# Altium project WR_NIC.PrjPcb (part 2 of 2)

## Sheet 13-Experimental.SchDoc
size B; SheetNumber: 10; SheetTotal: 17
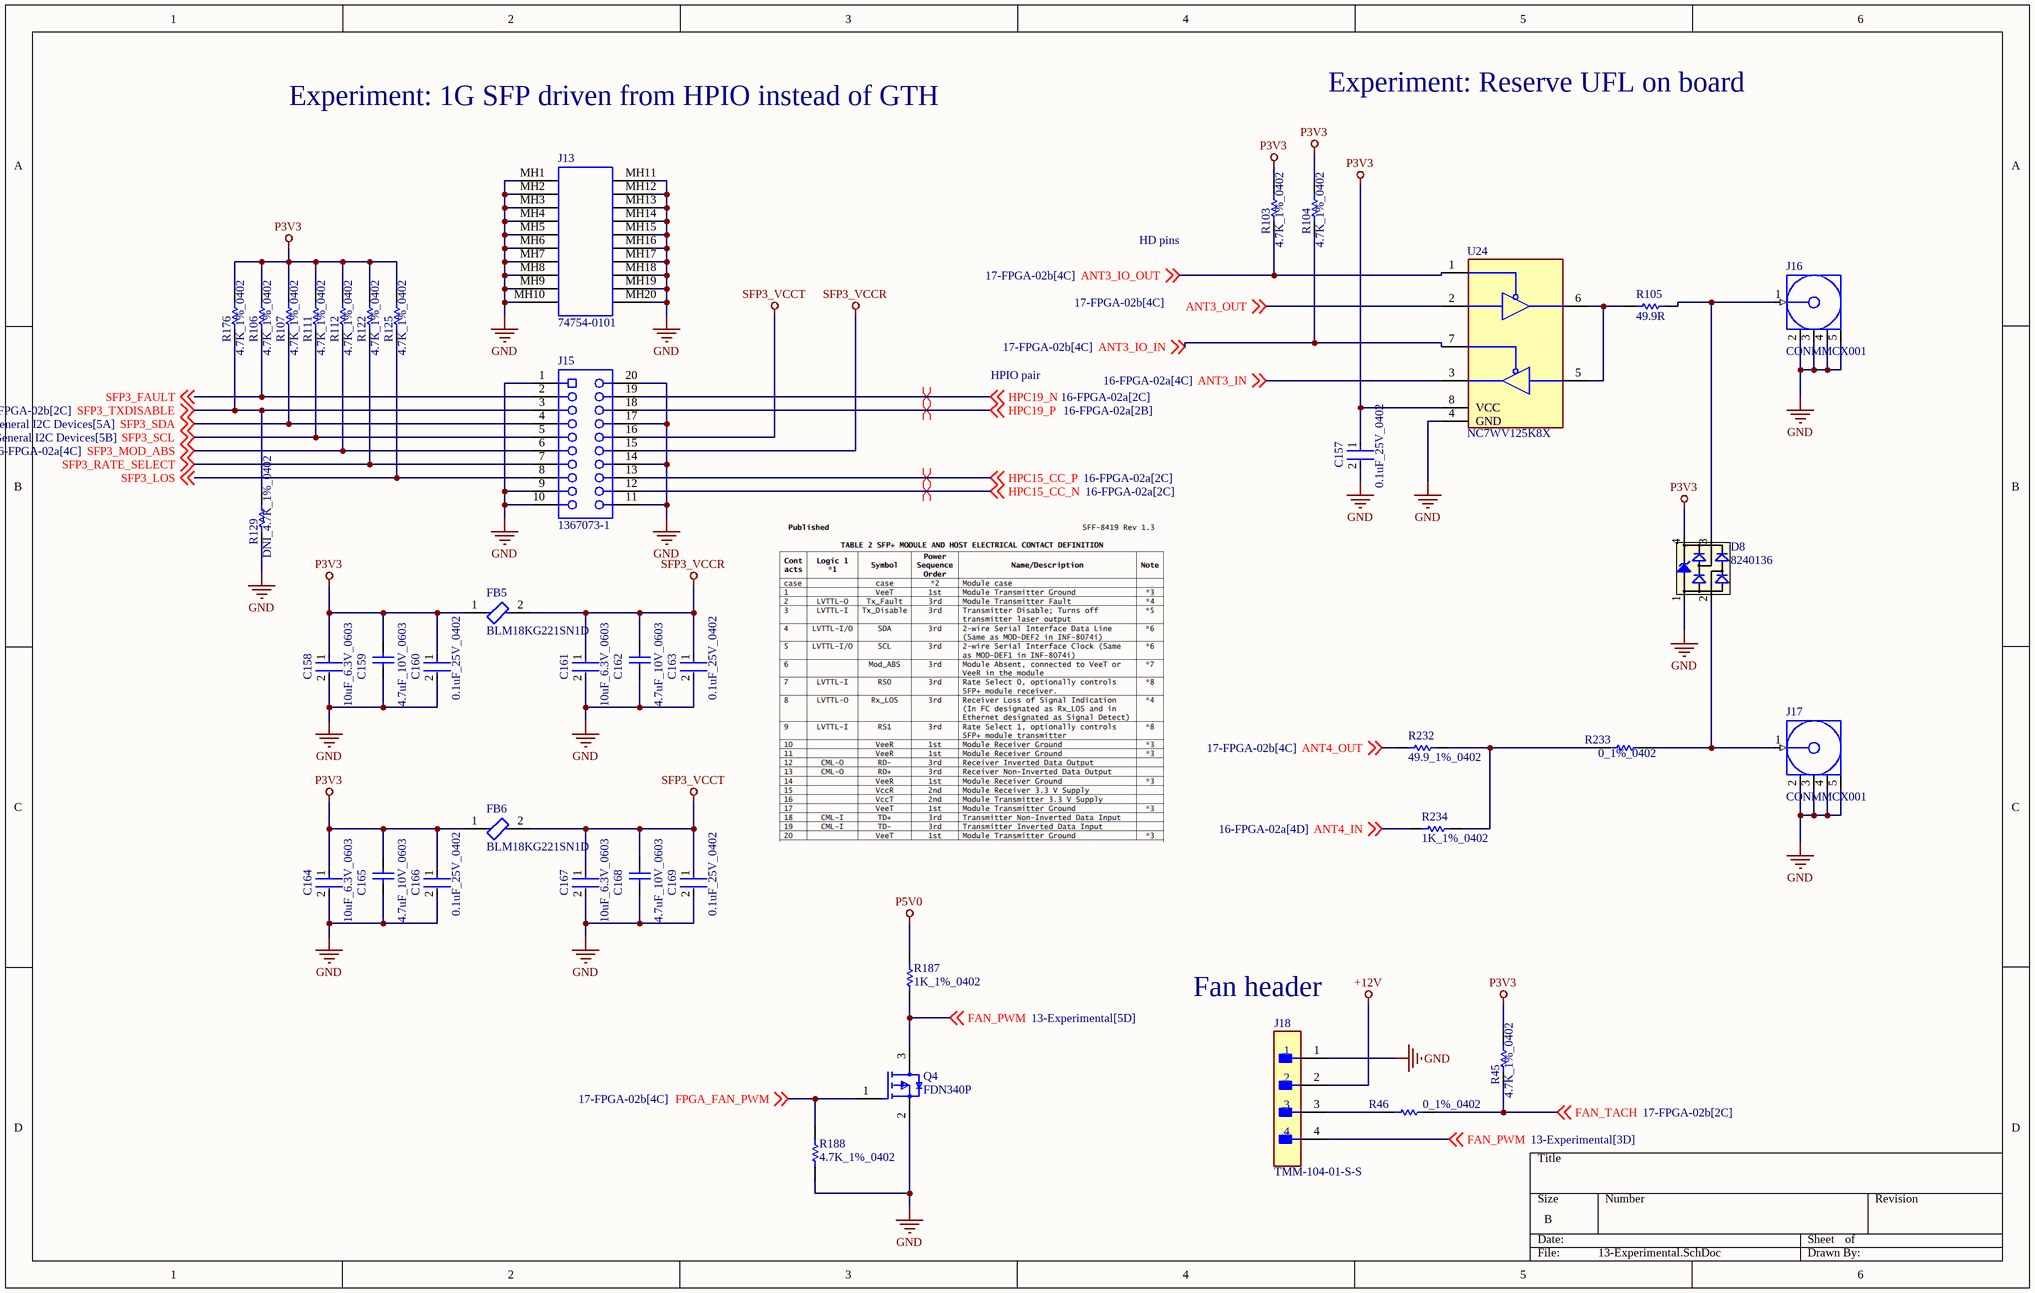
[diagram p4: 13-Experimental.SchDoc]

### Parts
C157  0.1uF_25V_0402  [FP-0402-L_1_0_1-W_0_5_0_1-IPC_C]
C158  10uF_6.3V_0603  [FP-C0603C106M9PACTU-MFG]
C159  4.7uF_10V_0603  [CAPC1608X87X35NL15T15]
C160  0.1uF_25V_0402  [FP-0402-L_1_0_1-W_0_5_0_1-IPC_C]
C161  10uF_6.3V_0603  [FP-C0603C106M9PACTU-MFG]
C162  4.7uF_10V_0603  [CAPC1608X87X35NL15T15]
C163  0.1uF_25V_0402  [FP-0402-L_1_0_1-W_0_5_0_1-IPC_C]
C164  10uF_6.3V_0603  [FP-C0603C106M9PACTU-MFG]
C165  4.7uF_10V_0603  [CAPC1608X87X35NL15T15]
C166  0.1uF_25V_0402  [FP-0402-L_1_0_1-W_0_5_0_1-IPC_C]
C167  10uF_6.3V_0603  [FP-C0603C106M9PACTU-MFG]
C168  4.7uF_10V_0603  [CAPC1608X87X35NL15T15]
C169  0.1uF_25V_0402  [FP-0402-L_1_0_1-W_0_5_0_1-IPC_C]
D8  8240136  [SOT143-4L]
FB5  BLM18KG221SN1D  [FP-BLM18-0_15-t0_8-IPC_B]
FB6  BLM18KG221SN1D  [FP-BLM18-0_15-t0_8-IPC_B]
J13  74754-0101  [MOLX-74754-0101_V]
J15  1367073-1  [TECO-1367073-1_V]
J16  CONMMCX001  [CON-MMCX]
J17  CONMMCX001  [CON-MMCX]
J18  TMM-104-01-S-S  [FP-TMM-104-01-S-S-MFG]
Q4  FDN340P  [FP-527AG-MFG]
R45  4.7K_1%_0402  [RESC1005X40X25NL10T10]
R46  0_1%_0402  [RESC1005X40X25LL05T05]
R103  4.7K_1%_0402  [RESC1005X40X25NL10T10]
R104  4.7K_1%_0402  [RESC1005X40X25NL10T10]
R105  49.9R  [RESC1608X55X25NL10T15]
R106  4.7K_1%_0402  [RESC1005X40X25NL10T10]
R107  4.7K_1%_0402  [RESC1005X40X25NL10T10]
R111  4.7K_1%_0402  [RESC1005X40X25NL10T10]
R112  4.7K_1%_0402  [RESC1005X40X25NL10T10]
R122  4.7K_1%_0402  [RESC1005X40X25NL10T10]
R125  4.7K_1%_0402  [RESC1005X40X25NL10T10]
R129  DNI_4.7K_1%_0402  [RESC1005X40X25NL10T10]  (no BOM)
R176  4.7K_1%_0402  [RESC1005X40X25NL10T10]
R187  1K_1%_0402  [RESC1005X40X25NL05T05]
R188  4.7K_1%_0402  [RESC1005X40X25NL10T10]
R232  49.9_1%_0402  [RESC1005X40X25NL10T10]
R233  0_1%_0402  [RESC1005X40X25LL05T05]
R234  1K_1%_0402  [RESC1005X40X25NL05T05]
U24  NC7WV125K8X  [SOP50P310X90-8N]

### Nets
+12V: J18.2
GND: C157.2 C158.2 C159.1 C160.2 C161.2 C162.1 C163.2 C164.2 C165.1 C166.2 C167.2 C168.1 C169.2 D8.1(GND) J13.MH1 J13.MH2 J13.MH3 J13.MH4 J13.MH5 J13.MH6 J13.MH7 J13.MH8 J13.MH9 J13.MH10 J13.MH11 J13.MH12 J13.MH13 J13.MH14 J13.MH15 J13.MH16 J13.MH17 J13.MH18 J13.MH19 J13.MH20 J15.1 J15.9 J15.10 J15.11 J15.14 J15.17 J15.20 J16.2(GND) J16.3(GND) J16.4(GND) J16.5(GND) J17.2(GND) J17.3(GND) J17.4(GND) J17.5(GND) J18.1 Q4.2(S) R129.2 R188.1 U24.4(GND)
P3V3: C157.1 C158.1 C159.2 C160.1 C164.1 C165.2 C166.1 D8.4(VDD) FB5.1 FB6.1 R45.1 R103.1 R104.1 R106.1 R107.1 R111.1 R112.1 R122.1 R125.1 R176.1 U24.8(VCC)
P5V0: R187.2
SFP3_VCCR: C161.1 C162.2 C163.1 FB5.2 J15.15
SFP3_VCCT: C167.1 C168.2 C169.1 FB6.2 J15.16
ANT3_IN: U24.3 ; off-sheet ANT3_IN
ANT3_IO_IN: R104.2 U24.7 ; off-sheet ANT3_IO_IN
ANT3_IO_OUT: R103.2 U24.1 ; off-sheet ANT3_IO_OUT
ANT3_OUT: U24.2 ; off-sheet ANT3_OUT
ANT4_IN: R234.1 ; off-sheet ANT4_IN
ANT4_OUT: R232.1 ; off-sheet ANT4_OUT
FAN_PWM: J18.4 Q4.3(D) R187.1 ; off-sheet FAN_PWM
FAN_TACH: R45.2 R46.2 ; off-sheet FAN_TACH
FPGA_FAN_PWM: Q4.1(G) R188.2 ; off-sheet FPGA_FAN_PWM
HPC15_CC_N: J15.12 ; off-sheet HPC15_CC_N
HPC15_CC_P: J15.13 ; off-sheet HPC15_CC_P
HPC19_N: J15.19 ; off-sheet HPC19_N
HPC19_P: J15.18 ; off-sheet HPC19_P
SFP3_FAULT: J15.2 R106.2 ; off-sheet SFP3_FAULT
SFP3_LOS: J15.8 R125.2 ; off-sheet SFP3_LOS
SFP3_MOD_ABS: J15.6 R112.2 ; off-sheet SFP3_MOD_ABS
SFP3_RATE_SELECT: J15.7 R122.2 ; off-sheet SFP3_RATE_SELECT
SFP3_SCL: J15.5 R111.2 ; off-sheet SFP3_SCL
SFP3_SDA: J15.4 R107.2 ; off-sheet SFP3_SDA
SFP3_TXDISABLE: J15.3 R129.1 R176.2 ; off-sheet SFP3_TXDISABLE
NetD8_2: D8.2(I/O1) J17.1(Signal) R233.2
NetD8_3: D8.3(I/O2) J16.1(Signal) R105.2
NetJ18_3: J18.3 R46.1
NetR105_1: R105.1 U24.5 U24.6
NetR232_2: R232.2 R233.1 R234.2

### Layout directives
differential pair: HPC15_CC_N, HPC15_CC_P, HPC19_N, HPC19_P

### Notes on the sheet
- Experiment: Reserve UFL on board
- Experiment: 1G SFP driven from HPIO instead of GTH
- HD pins
- HPIO pair
- Fan header

### Library data of the parts
C157 C160 C163 C166 C169 = CMP-2008-02519-2: General Purpose Ceramic Capacitor, 0402, 100nF, 10%, X7R, 15%, 25V; Package Quantity: 1; Capacitance: 100nF; Min Operating Temperature: -55°C; Voltage: 25V; Voltage Rating: 25V; Construction: Flat; Max Operating Temperature: 125°C; Radiation Hardening: No; Depth: 0.5mm; Thickness: 0.022inch; Voltage Rating (DC): 25V; Number of Pins: 2; Lead Free: Lead Free; Series: -; REACH SVHC: No SVHC; Length: 1mm; Dielectric: X7R; RoHS Compliant: Yes; Mount: Surface Mount; Packaging: Tape and Reel; Case/Package: 0402; Case Code (Imperial): 0402; Termination: SMD/SMT; Width: 0.02inch; Case Code (Metric): 1005; Tolerance: 10%
C158 C161 C164 C167 = CMP-2006-02285-3: CAP CER 10UF 6.3V X5R 0603; Manufacturer Part Number: C0603C106M9PACTU; Manufacturer: Kemet; Material: Ceramic; Temperature Coefficient: 15%; Tolerance: 20%; Category: Cap; Height: 0.9mm; Digikey Description: CAP CER 10UF 6.3V X5R 0603; Mouser Description: In a Pack of 10, KEMET 0603 (1608M) 10µF MLCC 6.3V dc ±20% SMD C0603C106M9PACTU; Voltage Rating: 6.3V; Device Class L2: Capacitors; Temperature Range Low: -55°C; Temperature Characteristic: X5R; ComponentLink2Description: Datasheet; Ipc Land Pattern Name: CAPC16080X80; ComponentLink2URL: http://www.kemet.com/Lists/ProductCatalog/Attachments/19/KEM_C1006_X5R_SMD.pdf; Capacitance: 10uF; Temperature Range High: +85°C; Device Class L3: Ceramic Capacitors; RoHS: TRUE; Automotive: No; Value: 10uF; Temperature: -55°C to +85°C; Device Class L1: Passive Components; Package: C0603C106M9PACTU; Lead Free: Yes; Octopart: https://octopart.com/c0603c106m9pactu-kemet-8375727
C159 C162 C165 C168 = CMP-2006-03238-1: Part Number: C0603C475K8PACTU; Manufacturer: Kemet
D8 = CMP-1486-00002-1: TVS Diode WE-TVS-HS, VRWM=3.3V; Manufacturer: Wuerth Elektronik; Reverse Stand Off Voltage: 3.3V; PartNumber: 8240136; ComponentLink1Description: Manufacturer URL; PackageReference: SOT143-4L; ComponentLink1URL: http://www.we-online.com; ComponentLink2Description: Datasheet; ComponentLink2URL: http://katalog.we-online.de/kataloge/eisos/media/pdf/8240136.pdf
FB5 FB6 = CMP-0686-00556-7: Chip Ferrite Bead, 0603, 220Ω @ 100MHz, 0.05Ω, 25%, 2.2A; DC Resistance (DCR): 50mR; Number of Circuits: 1; Impedance: 220R; Current Rating: 2.2A; Material: Ferrite; Test Frequency: 100MHz; Depth: 0.8mm; Series: BLM18K; RoHS Compliant: Yes; Termination: SMD/SMT; Max Current Rating: 2.2A; Case Code (Metric): 1608; Radiation Hardening: No; Number of Pins: 2; Length: 1.6mm; Lead Free: Lead Free; Package Quantity: 1; Height: 0.8mm; Core Material: Ferrite; Inductor Type: FERRITE BEAD; Min Operating Temperature: -55°C; Case/Package: 0603; Case Code (Imperial): 0603; Number of Lines: 1; Packaging: Tape and Reel; REACH SVHC: No SVHC; Max Operating Temperature: 125°C; Military Standard: Not; DC Resistance-Max: 50mR; Width: 0.8mm; DC Current: 2.2A; Max DC Current: 2.2A; Tolerance: 25%; Weight: 7.1E-05oz
J13 = CMP-1704-00003-3: SFP+ Cage, Single Port, Height 10.85 mm, Tail Height 3.05 mm, -40 to 85 degC, RoHS, Tray; RoHSCompliant: True; ComponentLink3URL: http://www.molex.com/pdm_docs/sd/747540101_sd.pdf; Width: 49 mm; Height: 10.85 mm; Mounting Technology: Through Hole; ComponentLink2Description: Datasheet; ComponentLink3Description: Package Specification; DatasheetVersion: Rev. Jul-15; Package Quantity: 1152; PackageDescription: SFP+ Cage, Single Port, Height 10.85 mm, Tail Height 3.05 mm; Radiation Hardening: No; PackageVersion: Rev. J, 02/2015; ComponentLink1Description: Manufacturer URL; PartNumber: 74754-0101; ComponentLink1URL: http://www.molex.com/; Packaging: Tray; Length: 15.9 mm; ComponentLink2URL: http://www.molex.com/webdocs/datasheets/pdf/en-us/0747540101_IO_CONNECTORS.pdf
J15 = CMP-2000-05488-1: Female Connector, Pitch 0.8 mm, 2 x 10 Position, Height 5.4 mm, -55 to 85 degC, RoHS, Tape and Reel; Manufacturer: TE Connectivity; Product Training Modules: HighSpeedPluggableI/OSolutions; 3D Model: 1367073-1.pdf; Connector Type: SFP; Other Names: A97430DKR; Mating Products: 516-2084-ND / -TXRXOPTICALSFF1.25GBDISCSI; Dynamic Catalog: SFPConnectors; Featured Product: HighSpeedPluggableI-OSolutions; Connector Style: Receptacle; Associated Product: A103997CT-ND / -CONNSFPCAGESINGLEW/OPIPE / A103997TR-ND / -CONNSFPCAGESINGLEW/OPIPE / 1367645-3-ND / -CONNCAGE&HEATSINKSGLPORTTIN / 1367645-2-ND / -CONNCAGE&HEATSINKSGLPORTTIN / 1888424-1-ND / -CONNCAGE1X2SFPENHANCEDEMI / 1367643-1-ND / -CONNCAGESNGLPORTDBLSIDETIN / 1489962-1-ND / -CONNSFPCAGESINGLEW/OPIPE / 1367645-1-ND / -CONNCAGE&HEATSINKSGLPORTTIN / A99375-ND / -CONNSFPCAGE1X4PIN-IN-PASTE / A97412CT-ND / -CONNSFPLOWERCAGEPCB / More...; Number of Positions: 20; Package Reference: 1367073-1; Package Description: Female Connector, Pitch 0.8 mm, 2 x 10 Position, Height 5.4 mm; RoHS Information: 1367073-1StatementofCompliance; Contact Finish: Gold; Datasheet URL: http://www.te.com/commerce/DocumentDelivery/DDEController?Action=showdoc&DocId=Customer+Drawing%7F1367073%7FK%7Fpdf%7FEnglish%7FENG_CD_1367073_K.pdf%7F1367073-1; Datasheet Version: Rev. K, 12/2012; Contact Finish Thickness: 15µin(0.38µm); Category: Connectors,Interconnects; Mounting Type: SurfaceMount,RightAngle; Mounting Technology: SurfaceMount; Packaging: Digi-Reel®; Manufacturer URL: http://www.te.com/; Family: PluggableConnectors; Standard Package: 1; Termination: Solder
J16 J17 = CMP-0168-00018-1: MMCX Female PCB Mount Connector, Thru-Hole; PCB_Layout: Pads complies with manufacturer's recommendation.; PackageReference: CON-MMCX; PackageDescription: MMCX Female PCB Mount Connector, Thru-Hole, 3.5 x 3.5 mm Body; DatasheetVersion: rev1.0, Jun-2006; PackageVersion: rev1.0, Jun-2006
J18 = CMP-02766-001674-1: CONN HEADER VERT 4POS 2MM; Max Current Rating: 3.9A; Connector Type: Male Pin; Max Voltage Rating (AC): 500V; Number of Contacts: 4; Gender: Male; Color: Black; Packaging: Bulk; Orientation: Straight; Contact Mating Length: 0.126inch; Contact Plating: Gold; Max Operating Temperature: 125°C; Housing Color: Black; Contact Material: Bronze; Package Quantity: 1; Housing Material: Polymer; Radiation Hardening: No; Pitch: 2mm; Contact Type: Male Pin; Number of Positions: 4; Number of Rows: 1; Lead Free: Lead Free; Width: 1.97mm; Termination: Solder; Depth: 1.97mm; Series: FleXYZ™ TMM; RoHS Compliant: Yes; Length: 8mm; Min Operating Temperature: -55°C; Mount: Through Hole
Q4 = CMP-2100-03638-2: MOSFET P-CH 20V 2A SSOT3; Fall Time: 11ns; Rise Time: 9ns; Voltage Rating (DC): -20V; Power Dissipation: 500mW; Nominal Vgs: -800mV; Current Rating: -2A; Gate to Source Voltage (Vgs): 8V; Rds On Max: 70mR; Turn-Off Delay Time: 27ns; Element Configuration: Single; Number of Elements: 1; Input Capacitance: 779pF; Drain to Source Resistance: 60mR; Turn-On Delay Time: 10ns; Package Quantity: 1; Mount: Surface Mount; Case/Package: SOT-23; Min Operating Temperature: -55°C; REACH SVHC: No SVHC; Weight: 0.03g; Packaging: Tape and Reel; Threshold Voltage: -800mV; Max Operating Temperature: 150°C; Dual Supply Voltage: -20V; Termination: SMD/SMT; Drain to Source Voltage (Vdss): 20V; Height: 0.94mm; Length: 2.92mm; Contact Plating: Tin; Width: 3.05mm; Drain to Source Breakdown Voltage: -20V; Max Power Dissipation: 500mW; Continuous Drain Current (ID): 2A; Number of Pins: 3; Lead Free: Lead Free; Radiation Hardening: No; On-State Resistance: 70MR
R45 R103 R104 R106 R107 R111 R112 R122 R125 R129 R176 R188 = CMP-2002-05217-1: Manufacturer: Bourns; Part Number: CR0402-FX-4701GLF
R46 R233 = CMP-2000-07451-1: Chip Resistor, 0 Ohm, 0.1 W, -55 to 155 degC, 0402 (1005 Metric), RoHS, Tape and Reel; Manufacturer: Panasonic; Voltage Rating (DC): 50V; Temperature Coefficient: 600ppm/��C; Max Power Dissipation: 100mW; Resistance: 0mOhm; Tolerance: 5%; Number of Terminations: 2; Mount: SurfaceMount; Height: 0.35mm; Packaging: TapeandReel; Contact Plating: Tin; Manufacturer URL: http://www.panasonic.com/; Composition: ThickFilm; Max Operating Temperature: 155degC; REACH SVHC: NoSVHC; Case/Package: 0402; Package Reference: 402; Depth: 0.5mm; Package Description: 2-Pin Surface Mount Device, Body 1 x 0.5 mm; Datasheet URL: https://industrial.panasonic.com/cdbs/www-data/pdf/RDA0000/AOA0000C301.pdf; RoHSCompliant: True; Case Code (Imperial): 0402; Military Standard: Not; Min Operating Temperature: -55degC; Power Rating: 100mW; Datasheet Version: 03/2015; Length: 1mm; Case Code (Metric): 1005; Termination: SMD/SMT; Mounting Technology: SurfaceMount; Voltage Rating: 50V; Width: 0.02inch; Package Quantity: 1; Lead Free: LeadFree; Radiation Hardening: No
R105 = CMP-1659-00036-1: General Purpose Chip Resistor, 49.9 Ohm, +/- 1%, -55 to 155 degC, 0603 (1608 Metric), RoHS, Tape and Reel; Max Supply Voltage: 3.63 V; Case\Package: LQFP; Interface: SPI; Min Supply Voltage: 2.97 V; PackageReference: 0603; Packaging: Tray; ComponentLink2Description: Datasheet; ComponentLink1Description: Manufacturer URL; ComponentLink2URL: https://datasheet.ciiva.com/11808/0900766b80f96399-11808223.pdf; RoHSCompliant: true; Max Operating Temperature: 85 degC; ComponentLink1URL: http://www.yageo.com/; PackageDescription: 2-Pin Surface Mount Device, Body 1.6 x 0.8 mm; DatasheetVersion: Rev. 4, 04/2009; Min Operating Temperature: -40 degC; Package Quantity: 250; Pins: 48
R187 R234 = CMP-2002-08277-1: Manufacturer: Vishay Dale; Part Number: CRCW04021K00FKTD
R232 = CMP-2002-04448-1: Part Number: RK73H1ETTP49R9F; Manufacturer: KOA Speer
U24 = NC7WV125K8X: Integrated Circuit; Manufacturer_Name: ON Semiconductor; Datasheet Link: https://www.mouser.com/datasheet/2/308/NC7WV125-1301459.pdf; Height: 0.9mm; Manufacturer_Part_Number: NC7WV125K8X; Mouser Part Number: 512-NC7WV125K8X; Mouser Price/Stock: https://www.mouser.com/Search/Refine.aspx?Keyword=512-NC7WV125K8X; Arrow Part Number: NC7WV125K8X; Arrow Price/Stock: https://www.arrow.com/en/products/nc7wv125k8x/on-semiconductor

## Sheet 14-FPGA-01a.SchDoc
size Tabloid; Customer: 01910; SheetNumber: 14; SheetTotal: 20
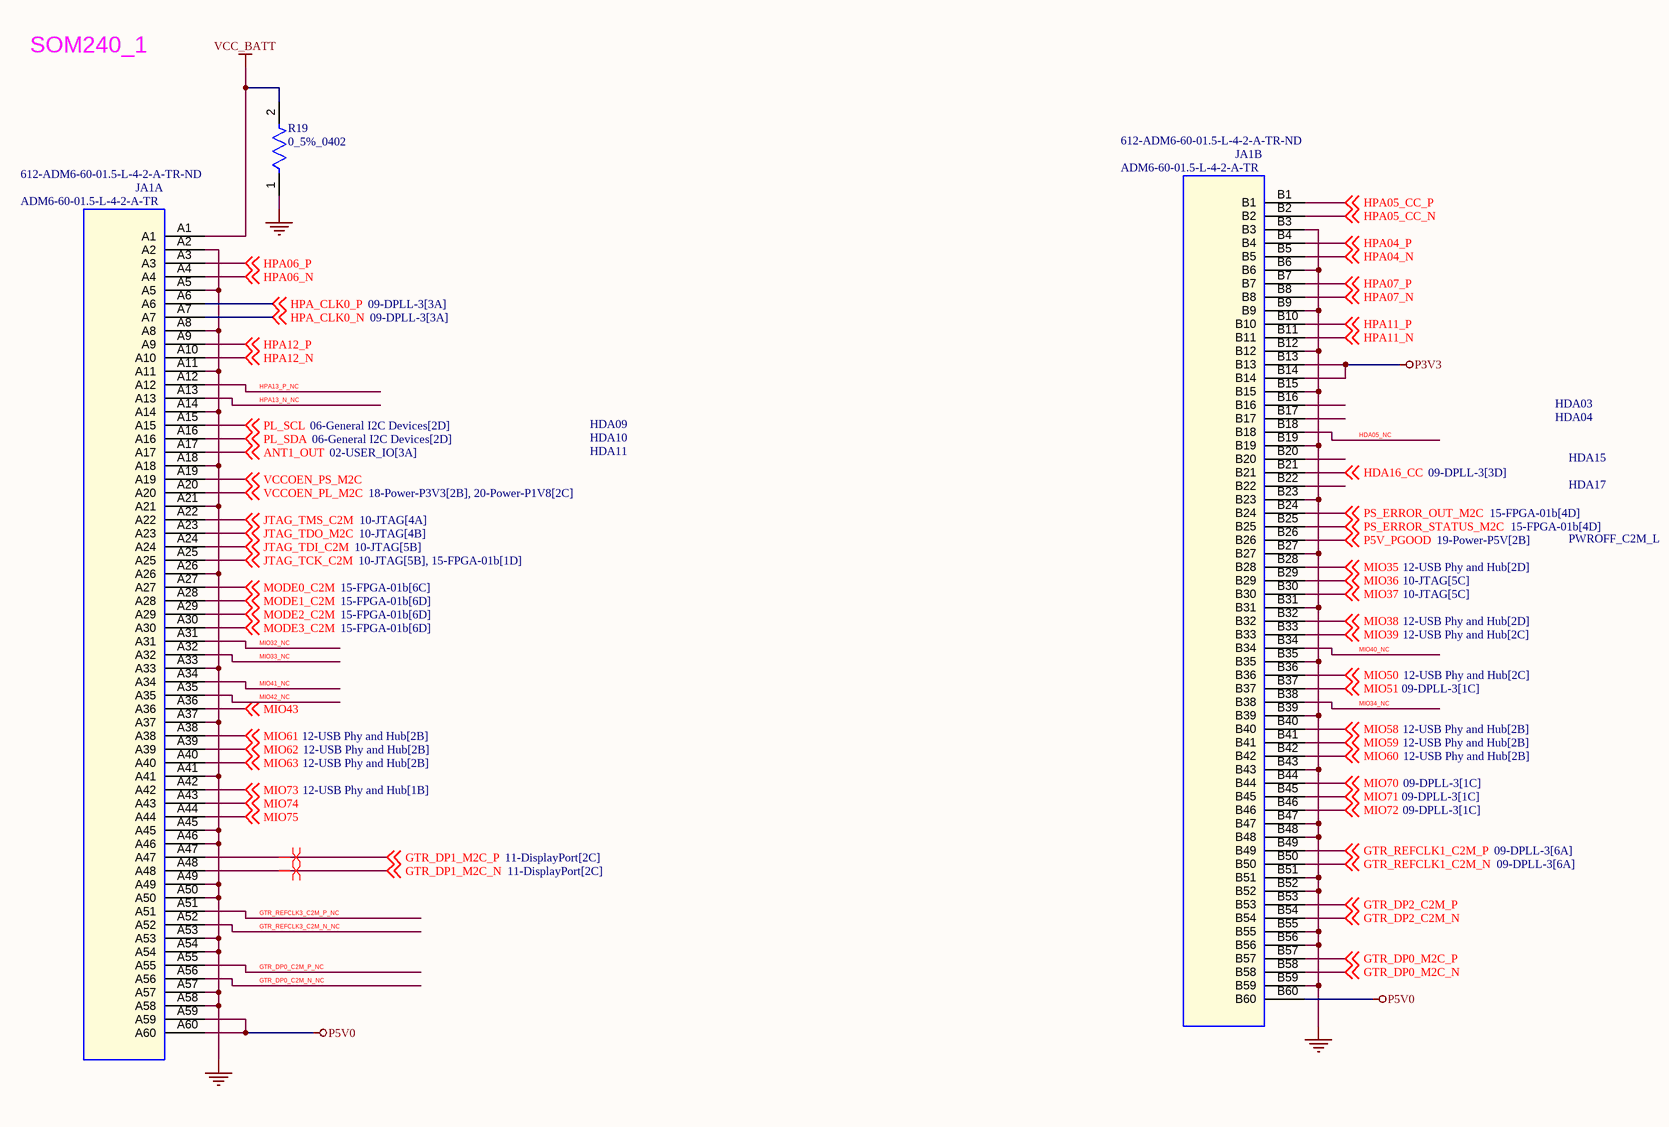
[diagram p5: 14-FPGA-01a.SchDoc]

### Parts
JA1  ADM6-60-01.5-L-4-2-A-TR  Supplier Part Number 1: 612-ADM6-60-01.5-L-4-2-A-TR-ND  [CON_SAMTEC_ADM6_60_4]  (parts A,B of 4)
R19  0_5%_0402  [FP-AC0402-0_37-IPC_B]

### Nets
GND: JA1.A2 JA1.A5 JA1.A8 JA1.A11 JA1.A14 JA1.A18 JA1.A21 JA1.A26 JA1.A33 JA1.A37 JA1.A41 JA1.A45 JA1.A46 JA1.A49 JA1.A50 JA1.A53 JA1.A54 JA1.A57 JA1.A58 JA1.B3 JA1.B6 JA1.B9 JA1.B12 JA1.B15 JA1.B19 JA1.B23 JA1.B27 JA1.B31 JA1.B35 JA1.B39 JA1.B43 JA1.B47 JA1.B48 JA1.B51 JA1.B52 JA1.B55 JA1.B56 JA1.B59 R19.1
P3V3: JA1.B13 JA1.B14
P5V0: JA1.A59 JA1.A60 JA1.B60
VCC_BATT: JA1.A1 R19.2
ANT1_OUT: JA1.A17 ; off-sheet ANT1_OUT
GTR_DP0_C2M_N_NC: JA1.A56
GTR_DP0_C2M_P_NC: JA1.A55
GTR_DP0_M2C_N: JA1.B58 ; off-sheet GTR_DP0_M2C_N
GTR_DP0_M2C_P: JA1.B57 ; off-sheet GTR_DP0_M2C_P
GTR_DP1_M2C_N: JA1.A48 ; off-sheet GTR_DP1_M2C_N
GTR_DP1_M2C_P: JA1.A47 ; off-sheet GTR_DP1_M2C_P
GTR_DP2_C2M_N: JA1.B54 ; off-sheet GTR_DP2_C2M_N
GTR_DP2_C2M_P: JA1.B53 ; off-sheet GTR_DP2_C2M_P
GTR_REFCLK1_C2M_N: JA1.B50 ; off-sheet GTR_REFCLK1_C2M_N
GTR_REFCLK1_C2M_P: JA1.B49 ; off-sheet GTR_REFCLK1_C2M_P
GTR_REFCLK3_C2M_N_NC: JA1.A52
GTR_REFCLK3_C2M_P_NC: JA1.A51
HDA05_NC: JA1.B18
HDA16_CC: JA1.B21 ; off-sheet HDA16_CC
HPA04_N: JA1.B5 ; off-sheet HPA04_N
HPA04_P: JA1.B4 ; off-sheet HPA04_P
HPA05_CC_N: JA1.B2 ; off-sheet HPA05_CC_N
HPA05_CC_P: JA1.B1 ; off-sheet HPA05_CC_P
HPA06_N: JA1.A4 ; off-sheet HPA06_N
HPA06_P: JA1.A3 ; off-sheet HPA06_P
HPA07_N: JA1.B8 ; off-sheet HPA07_N
HPA07_P: JA1.B7 ; off-sheet HPA07_P
HPA11_N: JA1.B11 ; off-sheet HPA11_N
HPA11_P: JA1.B10 ; off-sheet HPA11_P
HPA12_N: JA1.A10 ; off-sheet HPA12_N
HPA12_P: JA1.A9 ; off-sheet HPA12_P
HPA13_N_NC: JA1.A13
HPA13_P_NC: JA1.A12
HPA_CLK0_N: JA1.A7 ; off-sheet HPA_CLK0_N
HPA_CLK0_P: JA1.A6 ; off-sheet HPA_CLK0_P
JTAG_TCK_C2M: JA1.A25 ; off-sheet JTAG_TCK_C2M
JTAG_TDI_C2M: JA1.A24 ; off-sheet JTAG_TDI_C2M
JTAG_TDO_M2C: JA1.A23 ; off-sheet JTAG_TDO_M2C
JTAG_TMS_C2M: JA1.A22 ; off-sheet JTAG_TMS_C2M
MIO32_NC: JA1.A31
MIO33_NC: JA1.A32
MIO34_NC: JA1.B38
MIO35: JA1.B28 ; off-sheet MIO35
MIO36: JA1.B29 ; off-sheet MIO36
MIO37: JA1.B30 ; off-sheet MIO37
MIO38: JA1.B32 ; off-sheet MIO38
MIO39: JA1.B33 ; off-sheet MIO39
MIO40_NC: JA1.B34
MIO41_NC: JA1.A34
MIO42_NC: JA1.A35
MIO43: JA1.A36 ; off-sheet MIO43
MIO50: JA1.B36 ; off-sheet MIO50
MIO51: JA1.B37 ; off-sheet MIO51
MIO58: JA1.B40 ; off-sheet MIO58
MIO59: JA1.B41 ; off-sheet MIO59
MIO60: JA1.B42 ; off-sheet MIO60
MIO61: JA1.A38 ; off-sheet MIO61
MIO62: JA1.A39 ; off-sheet MIO62
MIO63: JA1.A40 ; off-sheet MIO63
MIO70: JA1.B44 ; off-sheet MIO70
MIO71: JA1.B45 ; off-sheet MIO71
MIO72: JA1.B46 ; off-sheet MIO72
MIO73: JA1.A42 ; off-sheet MIO73
MIO74: JA1.A43 ; off-sheet MIO74
MIO75: JA1.A44 ; off-sheet MIO75
MODE0_C2M: JA1.A27 ; off-sheet MODE0_C2M
MODE1_C2M: JA1.A28 ; off-sheet MODE1_C2M
MODE2_C2M: JA1.A29 ; off-sheet MODE2_C2M
MODE3_C2M: JA1.A30 ; off-sheet MODE3_C2M
P5V_PGOOD: JA1.B26 ; off-sheet P5V_PGOOD
PL_SCL: JA1.A15 ; off-sheet PL_SCL
PL_SDA: JA1.A16 ; off-sheet PL_SDA
PS_ERROR_OUT_M2C: JA1.B24 ; off-sheet PS_ERROR_OUT_M2C
PS_ERROR_STATUS_M2C: JA1.B25 ; off-sheet PS_ERROR_STATUS_M2C
VCCOEN_PL_M2C: JA1.A20 ; off-sheet VCCOEN_PL_M2C
VCCOEN_PS_M2C: JA1.A19 ; off-sheet VCCOEN_PS_M2C

Not connected (* = marked no-connect by the designer): JA1 B16 B17 B20 B22

### Layout directives
differential pair: GTR_DP1_M2C_N, GTR_DP1_M2C_P

### Notes on the sheet
- SOM240_1
- HDA09
- HDA03
- HDA04
- HDA10
- HDA11
- HDA15
- HDA17
- PWROFF_C2M_L
- SHEET
- REV
- timingcard.com <http://timingcard.com>
- DATE
- OF

### Library data of the parts
JA1 = SAMTEC-ADx6-60X4: Conn Rcpt Male Vert 240 Pos 4x60 0.635mm P Black SMT; Manufacturer: Samtec Inc.; Agile Part Number: CON-00383-01; SPLIT_INST: TRUE; SWAP_INFO: (S1+S2+S3+S4); Pitch: 0.025" (0.64mm); Barcode: 40000092; Datasheet: http://suddendocs.samtec.com/catalog_english/adf6.pdf; Manufacturer PN: ADM6-60-01.5-L-4-2-A-TR; PCB Footprint: CON_SAMTEC_ADM6_60_4; CIP Link: http://xsjbrdwin1/CIP-E/Component/Index/All?pn=40000092; Number of Pins: 240; Part Type: CONNECTOR; Supplier 1: Digi-Key
R19 = CMP-2002-01772-2: RESISTOR 0402 JUMPER ZERO OHM; Voltage Rating: 50V; Temperature Coefficient: 200ppm/°C; Tolerance: 1%; Power Rating: 62.5mW; Resistance: 0R; Min Operating Temperature: -55°C; Termination: SMD/SMT; Case/Package: 0402; Case Code (Imperial): 0402; Packaging: Tape and Reel; Case Code (Metric): 1005; Max Operating Temperature: 155°C; Series: AC

## Sheet 16-FPGA-02a.SchDoc
size B; SheetNumber: 16; SheetTotal: 19
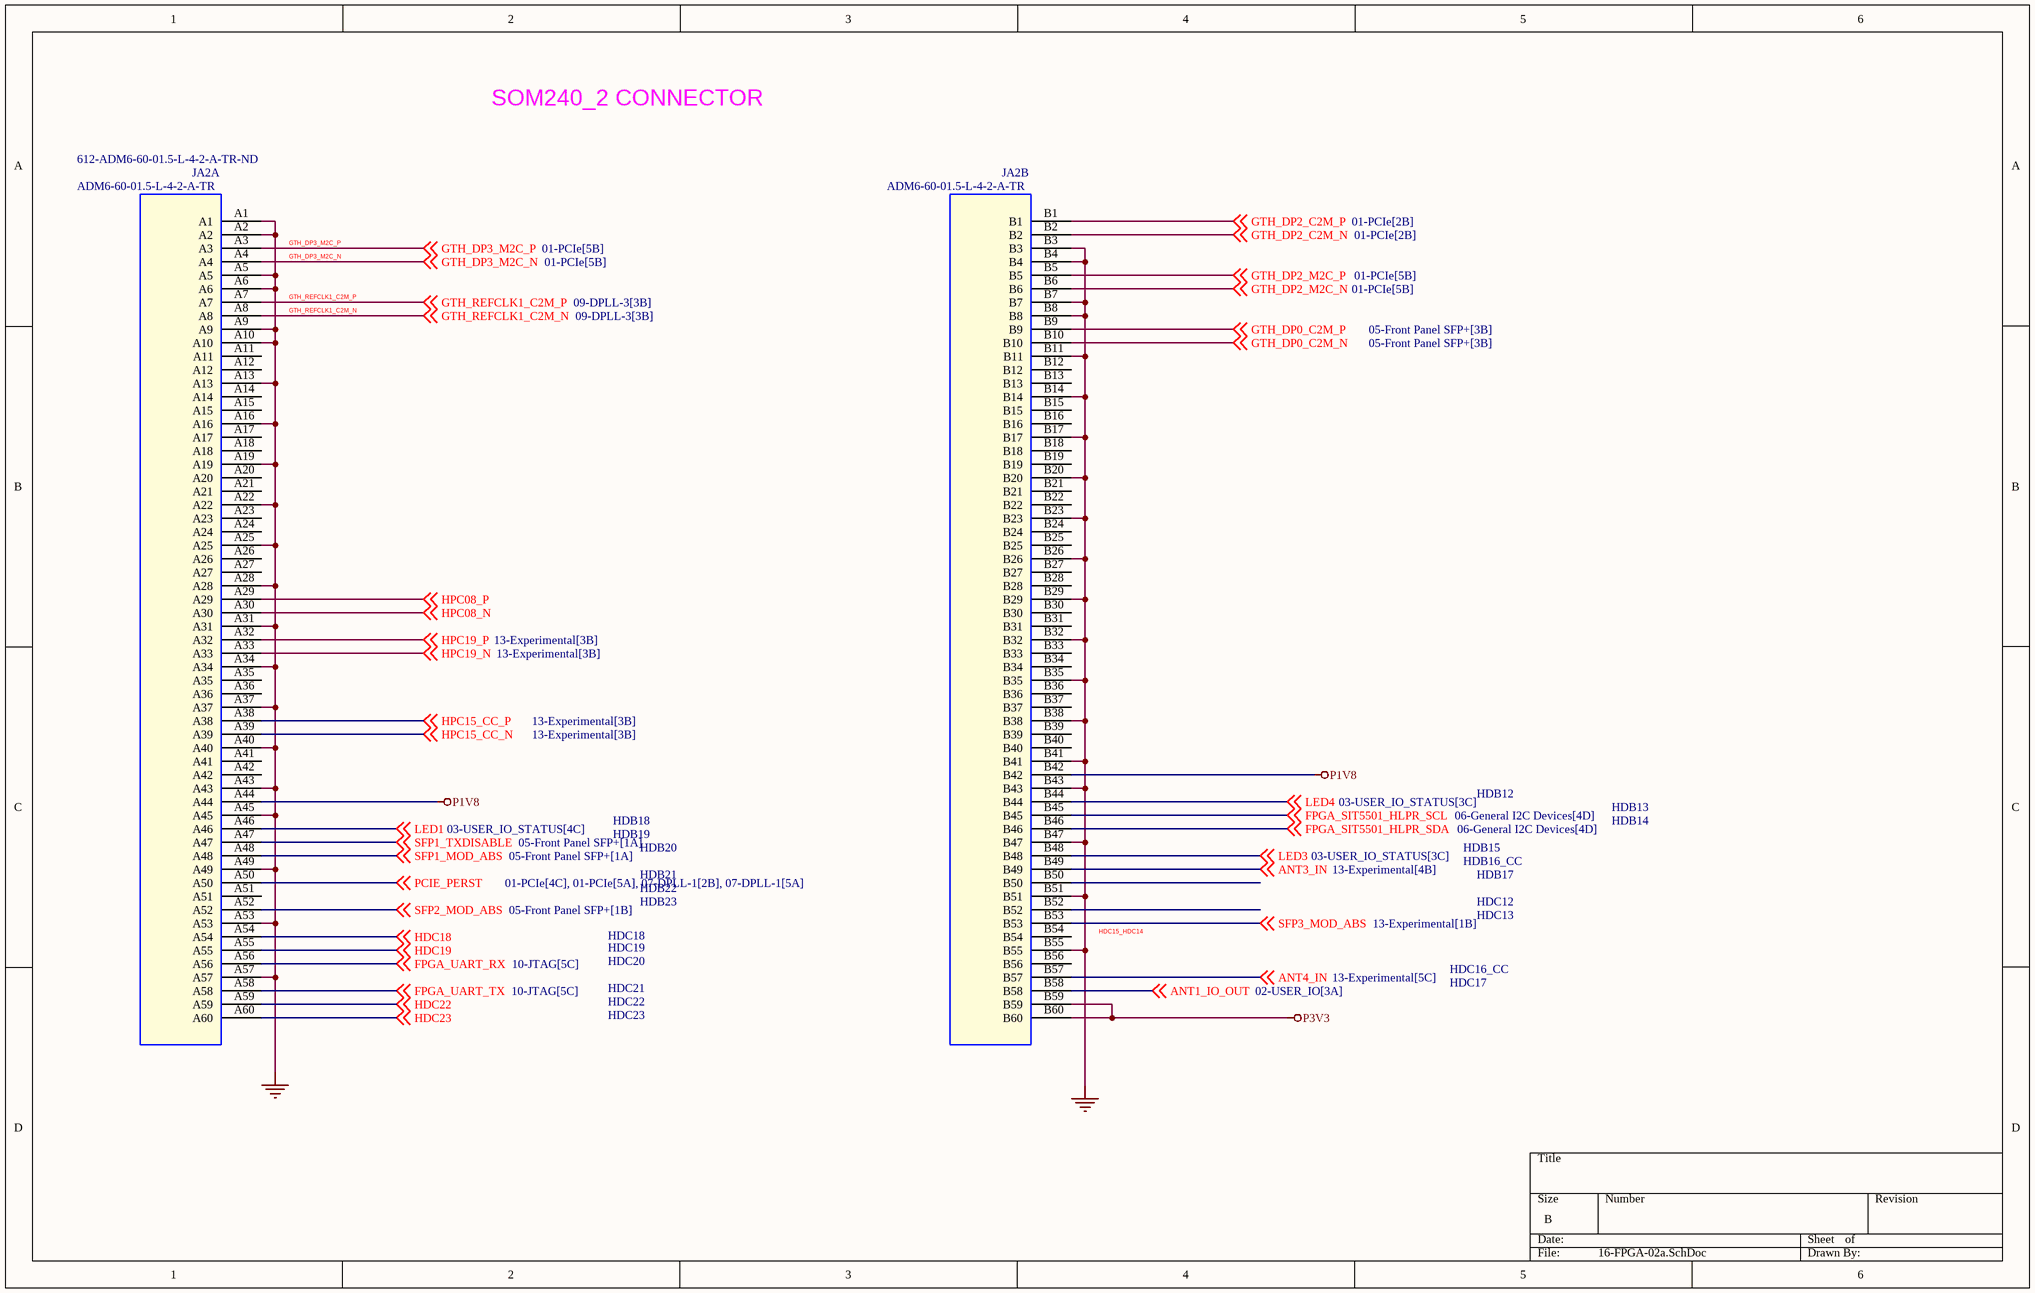
[diagram p6: 16-FPGA-02a.SchDoc]

### Parts
JA2  ADM6-60-01.5-L-4-2-A-TR  Supplier Part Number 1: 612-ADM6-60-01.5-L-4-2-A-TR-ND  [CON_SAMTEC_ADM6_60_4]  (parts A,B of 4)

### Nets
GND: JA2.A1 JA2.A2 JA2.A5 JA2.A6 JA2.A9 JA2.A10 JA2.A13 JA2.A16 JA2.A19 JA2.A22 JA2.A25 JA2.A28 JA2.A31 JA2.A34 JA2.A37 JA2.A40 JA2.A43 JA2.A45 JA2.A49 JA2.A53 JA2.A57 JA2.B3 JA2.B4 JA2.B7 JA2.B8 JA2.B11 JA2.B14 JA2.B17 JA2.B20 JA2.B23 JA2.B26 JA2.B29 JA2.B32 JA2.B35 JA2.B38 JA2.B41 JA2.B43 JA2.B47 JA2.B51 JA2.B55
P1V8: JA2.A44 JA2.B42
P3V3: JA2.B59 JA2.B60
ANT1_IO_OUT: JA2.B58 ; off-sheet ANT1_IO_OUT
ANT3_IN: JA2.B49 ; off-sheet ANT3_IN
ANT4_IN: JA2.B57 ; off-sheet ANT4_IN
FPGA_SIT5501_HLPR_SCL: JA2.B45 ; off-sheet FPGA_SIT5501_HLPR_SCL
FPGA_SIT5501_HLPR_SDA: JA2.B46 ; off-sheet FPGA_SIT5501_HLPR_SDA
FPGA_UART_RX: JA2.A56 ; off-sheet FPGA_UART_RX
FPGA_UART_TX: JA2.A58 ; off-sheet FPGA_UART_TX
GTH_DP0_C2M_N: JA2.B10 ; off-sheet GTH_DP0_C2M_N
GTH_DP0_C2M_P: JA2.B9 ; off-sheet GTH_DP0_C2M_P
GTH_DP2_C2M_N: JA2.B2 ; off-sheet GTH_DP2_C2M_N
GTH_DP2_C2M_P: JA2.B1 ; off-sheet GTH_DP2_C2M_P
GTH_DP2_M2C_N: JA2.B6 ; off-sheet GTH_DP2_M2C_N
GTH_DP2_M2C_P: JA2.B5 ; off-sheet GTH_DP2_M2C_P
GTH_DP3_M2C_N: JA2.A4 ; off-sheet GTH_DP3_M2C_N
GTH_DP3_M2C_P: JA2.A3 ; off-sheet GTH_DP3_M2C_P
GTH_REFCLK1_C2M_N: JA2.A8 ; off-sheet GTH_REFCLK1_C2M_N
GTH_REFCLK1_C2M_P: JA2.A7 ; off-sheet GTH_REFCLK1_C2M_P
HDC18: JA2.A54 ; off-sheet HDC18
HDC19: JA2.A55 ; off-sheet HDC19
HDC22: JA2.A59 ; off-sheet HDC22
HDC23: JA2.A60 ; off-sheet HDC23
HPC08_N: JA2.A30 ; off-sheet HPC08_N
HPC08_P: JA2.A29 ; off-sheet HPC08_P
HPC15_CC_N: JA2.A39 ; off-sheet HPC15_CC_N
HPC15_CC_P: JA2.A38 ; off-sheet HPC15_CC_P
HPC19_N: JA2.A33 ; off-sheet HPC19_N
HPC19_P: JA2.A32 ; off-sheet HPC19_P
LED1: JA2.A46 ; off-sheet LED1
LED3: JA2.B48 ; off-sheet LED3
LED4: JA2.B44 ; off-sheet LED4
PCIE_PERST: JA2.A50 ; off-sheet PCIE_PERST
SFP1_MOD_ABS: JA2.A48 ; off-sheet SFP1_MOD_ABS
SFP1_TXDISABLE: JA2.A47 ; off-sheet SFP1_TXDISABLE
SFP2_MOD_ABS: JA2.A52 ; off-sheet SFP2_MOD_ABS
SFP3_MOD_ABS: JA2.B53 ; off-sheet SFP3_MOD_ABS

Not connected (* = marked no-connect by the designer): JA2 A11 A12 A14 A15 A17 A18 A20 A21 A23 A24 A26 A27 A35 A36 A41 A42 A51 B12 B13 B15 B16 B18 B19 B21 B22 B24 B25 B27 B28 B30 B31 B33 B34 B36 B37 B39 B40 B50 B52 B54 B56

### Notes on the sheet
- SOM240_2 CONNECTOR
- HDB18
- HDB19
- HDB12
- HDB14
- HDB13
- HDB20
- HDB21
- HDB22
- HDB23
- HDB16_CC
- HDB15
- HDB17
- HDC12
- HDC18
- HDC19
- HDC20
- HDC16_CC
- HDC13
- HDC21
- HDC22
- HDC23
- HDC17
- Labels drawn without touching a wire or pin: HDC15_HDC14

### Library data of the parts
JA2 = SAMTEC-ADx6-60X4: Conn Rcpt Male Vert 240 Pos 4x60 0.635mm P Black SMT; Manufacturer: Samtec Inc.; Agile Part Number: CON-00383-01; SPLIT_INST: TRUE; SWAP_INFO: (S1+S2+S3+S4); Barcode: 40000092; Pitch: 0.025" (0.64mm); Datasheet: http://suddendocs.samtec.com/catalog_english/adf6.pdf; Manufacturer PN: ADM6-60-01.5-L-4-2-A-TR; PCB Footprint: CON_SAMTEC_ADM6_60_4; Part Type: CONNECTOR; Number of Pins: 240; CIP Link: http://xsjbrdwin1/CIP-E/Component/Index/All?pn=40000092; Supplier 1: Digi-Key

## Nets that join several sheets
GND: 05-Front Panel SFP+ (80 pins), 06-General I2C Devices (17 pins), 08-DPLL-2 (82 pins), 09-DPLL-3 (13 pins), 13-Experimental (54 pins), 14-FPGA-01a (39 pins), 16-FPGA-02a (40 pins)
P1V8: 06-General I2C Devices (5 pins), 08-DPLL-2 (13 pins), 16-FPGA-02a (JA2.A44 JA2.B42)
P3V3: 05-Front Panel SFP+ (30 pins), 06-General I2C Devices (32 pins), 08-DPLL-2 (43 pins), 09-DPLL-3 (6 pins), 13-Experimental (21 pins), 14-FPGA-01a (JA1.B13 JA1.B14), 16-FPGA-02a (JA2.B59 JA2.B60)
P5V0: 13-Experimental (R187.2), 14-FPGA-01a (JA1.A59 JA1.A60 JA1.B60)
ANT3_IN: 13-Experimental (U24.3), 16-FPGA-02a (JA2.B49)
ANT4_IN: 13-Experimental (R234.1), 16-FPGA-02a (JA2.B57)
FPGA_SIT5501_HLPR_SCL: 06-General I2C Devices (R231.1), 16-FPGA-02a (JA2.B45)
FPGA_SIT5501_HLPR_SDA: 06-General I2C Devices (R230.1), 16-FPGA-02a (JA2.B46)
GTH_DP0_C2M_N: 05-Front Panel SFP+ (J8.12), 16-FPGA-02a (JA2.B10)
GTH_DP0_C2M_P: 05-Front Panel SFP+ (J8.13), 16-FPGA-02a (JA2.B9)
GTH_REFCLK1_C2M_N: 09-DPLL-3 (C277.2 R193.2), 16-FPGA-02a (JA2.A8)
GTH_REFCLK1_C2M_P: 09-DPLL-3 (C276.2 R193.1), 16-FPGA-02a (JA2.A7)
GTR_REFCLK1_C2M_N: 09-DPLL-3 (C275.2 R191.2), 14-FPGA-01a (JA1.B50)
GTR_REFCLK1_C2M_P: 09-DPLL-3 (C273.2 R191.1), 14-FPGA-01a (JA1.B49)
HDA16_CC: 09-DPLL-3 (R245.1), 14-FPGA-01a (JA1.B21)
HDC18: 09-DPLL-3 (R239.1), 16-FPGA-02a (JA2.A54)
HDC19: 09-DPLL-3 (R237.1), 16-FPGA-02a (JA2.A55)
HDC22: 09-DPLL-3 (R243.1), 16-FPGA-02a (JA2.A59)
HDC23: 09-DPLL-3 (R241.1), 16-FPGA-02a (JA2.A60)
HPA_CLK0_N: 09-DPLL-3 (C268.2 R189.2), 14-FPGA-01a (JA1.A7)
HPA_CLK0_P: 09-DPLL-3 (C266.2 R189.1), 14-FPGA-01a (JA1.A6)
HPC15_CC_N: 13-Experimental (J15.12), 16-FPGA-02a (JA2.A39)
HPC15_CC_P: 13-Experimental (J15.13), 16-FPGA-02a (JA2.A38)
HPC19_N: 13-Experimental (J15.19), 16-FPGA-02a (JA2.A33)
HPC19_P: 13-Experimental (J15.18), 16-FPGA-02a (JA2.A32)
MIO51: 09-DPLL-3 (R201.1), 14-FPGA-01a (JA1.B37)
MIO70: 09-DPLL-3 (R199.1), 14-FPGA-01a (JA1.B44)
MIO71: 09-DPLL-3 (R198.1), 14-FPGA-01a (JA1.B45)
MIO72: 09-DPLL-3 (R197.1), 14-FPGA-01a (JA1.B46)
PL_SCL: 06-General I2C Devices (R215.1), 14-FPGA-01a (JA1.A15)
PL_SDA: 06-General I2C Devices (R214.1), 14-FPGA-01a (JA1.A16)
SFP1_MOD_ABS: 05-Front Panel SFP+ (J6.6 R5.2), 16-FPGA-02a (JA2.A48)
SFP1_SCL: 05-Front Panel SFP+ (J6.5 R4.2), 06-General I2C Devices (R120.1 U27.3)
SFP1_SDA: 05-Front Panel SFP+ (J6.4 R3.2), 06-General I2C Devices (R119.1 U27.2)
SFP1_TXDISABLE: 05-Front Panel SFP+ (J6.3 R9.1 R165.2), 16-FPGA-02a (JA2.A47)
SFP2_MOD_ABS: 05-Front Panel SFP+ (J8.6 R13.2), 16-FPGA-02a (JA2.A52)
SFP2_SCL: 05-Front Panel SFP+ (J8.5 R12.2), 06-General I2C Devices (R118.1 U27.5)
SFP2_SDA: 05-Front Panel SFP+ (J8.4 R11.2), 06-General I2C Devices (R117.1 U27.4)
SFP3_MOD_ABS: 13-Experimental (J15.6 R112.2), 16-FPGA-02a (JA2.B53)
SFP3_SCL: 06-General I2C Devices (R116.1 U27.8), 13-Experimental (J15.5 R111.2)
SFP3_SDA: 06-General I2C Devices (R115.1 U27.7), 13-Experimental (J15.4 R107.2)
SiT5501_HLPR_SCL: 06-General I2C Devices (R231.2 U40.5), 09-DPLL-3 (R249.1 Y3.3)
SiT5501_HLPR_SDA: 06-General I2C Devices (R230.2 U40.4), 09-DPLL-3 (R250.1 Y3.2)
SiT5501_PLL_SCL: 06-General I2C Devices (R229.2 U40.7), 08-DPLL-2 (Y2.3)
SiT5501_PLL_SDA: 06-General I2C Devices (R228.2 U40.6), 08-DPLL-2 (Y2.2)